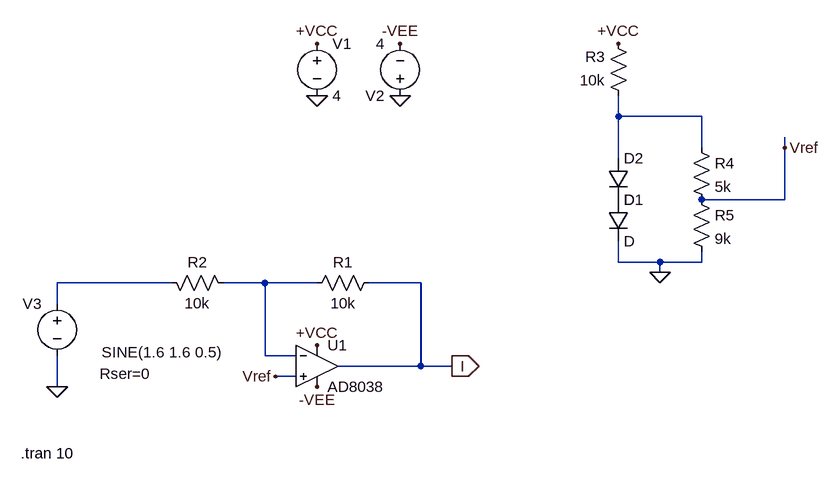
[diagram p0: schematic amp_off.asc]
amp_off.asc, the LTspice schematic file:
Version 4
SHEET 1 1152 680
WIRE 656 32 656 0
WIRE 784 32 656 32
WIRE 784 80 784 32
WIRE 912 80 912 64
WIRE 656 96 656 32
WIRE 912 160 912 80
WIRE 912 160 784 160
WIRE 656 256 656 224
WIRE 720 256 656 256
WIRE 784 256 784 240
WIRE 784 256 720 256
WIRE 720 272 720 256
WIRE -32 288 -208 288
WIRE 112 288 48 288
WIRE 192 288 112 288
WIRE 352 288 272 288
WIRE -208 320 -208 288
WIRE 112 400 112 288
WIRE 160 400 112 400
WIRE 352 416 352 288
WIRE 352 416 224 416
WIRE 400 416 352 416
WIRE 160 432 128 432
WIRE -208 448 -208 400
FLAG 192 0 0
FLAG 192 -80 +VCC
FLAG 320 0 0
FLAG 320 -80 -VEE
FLAG 192 384 +VCC
FLAG 192 448 -VEE
FLAG 400 416 I
IOPIN 400 416 Out
FLAG 128 432 Vref
FLAG -208 448 0
FLAG 656 -80 +VCC
FLAG 720 272 0
FLAG 912 80 Vref
SYMBOL voltage 192 -96 R0
WINDOW 123 0 0 Left 2
WINDOW 39 0 0 Left 2
SYMATTR InstName V1
SYMATTR Value 4
SYMBOL voltage 320 16 R180
WINDOW 123 0 0 Left 2
WINDOW 39 0 0 Left 2
SYMATTR InstName V2
SYMATTR Value 4
SYMBOL res 288 272 R90
WINDOW 0 0 56 VBottom 2
WINDOW 3 32 56 VTop 2
SYMATTR InstName R1
SYMATTR Value 10k
SYMBOL OpAmps\\AD8038 192 352 R0
SYMATTR InstName U1
SYMBOL res -48 272 M90
WINDOW 0 0 56 VBottom 2
WINDOW 3 32 56 VTop 2
SYMATTR InstName R2
SYMATTR Value 10k
SYMBOL voltage -208 304 M0
WINDOW 123 0 0 Left 2
WINDOW 39 -144 124 Left 2
WINDOW 3 -255 91 Left 2
SYMATTR SpiceLine Rser=0
SYMATTR Value SINE(1.6 1.6 0.5)
SYMATTR InstName V3
SYMBOL res 672 16 R180
WINDOW 0 36 76 Left 2
WINDOW 3 36 40 Left 2
SYMATTR InstName R3
SYMATTR Value 10k
SYMBOL diode 640 160 R0
SYMATTR InstName D1
SYMBOL diode 640 96 R0
SYMATTR InstName D2
SYMBOL res 768 64 R0
SYMATTR InstName R4
SYMATTR Value 5k
SYMBOL res 768 144 R0
SYMATTR InstName R5
SYMATTR Value 9k
TEXT -264 550 Left 2 !.tran 10

The netlist it stands for:
* amp_off.asc
V1 +VCC 0 4
V2 0 -VEE 4
R1 I N003 10k
XU1 Vref N003 +VCC -VEE I AD8038  ; pins In+ In- V+ V- OUT
R2 N002 N003 10k
V3 N002 0 SINE(1.6 1.6 0.5) Rser=0
R3 N001 +VCC 10k
D1 P001 0 D
D2 N001 P001 D
R4 N001 Vref 5k
R5 Vref 0 9k
.model D D
.lib standard.dio
.tran 10
.backanno
.end